# EAGLE schematic DAC STM32 Board v6.1 - AD5391 (EAGLE 9.6.1)

## Sheet 1 of 2
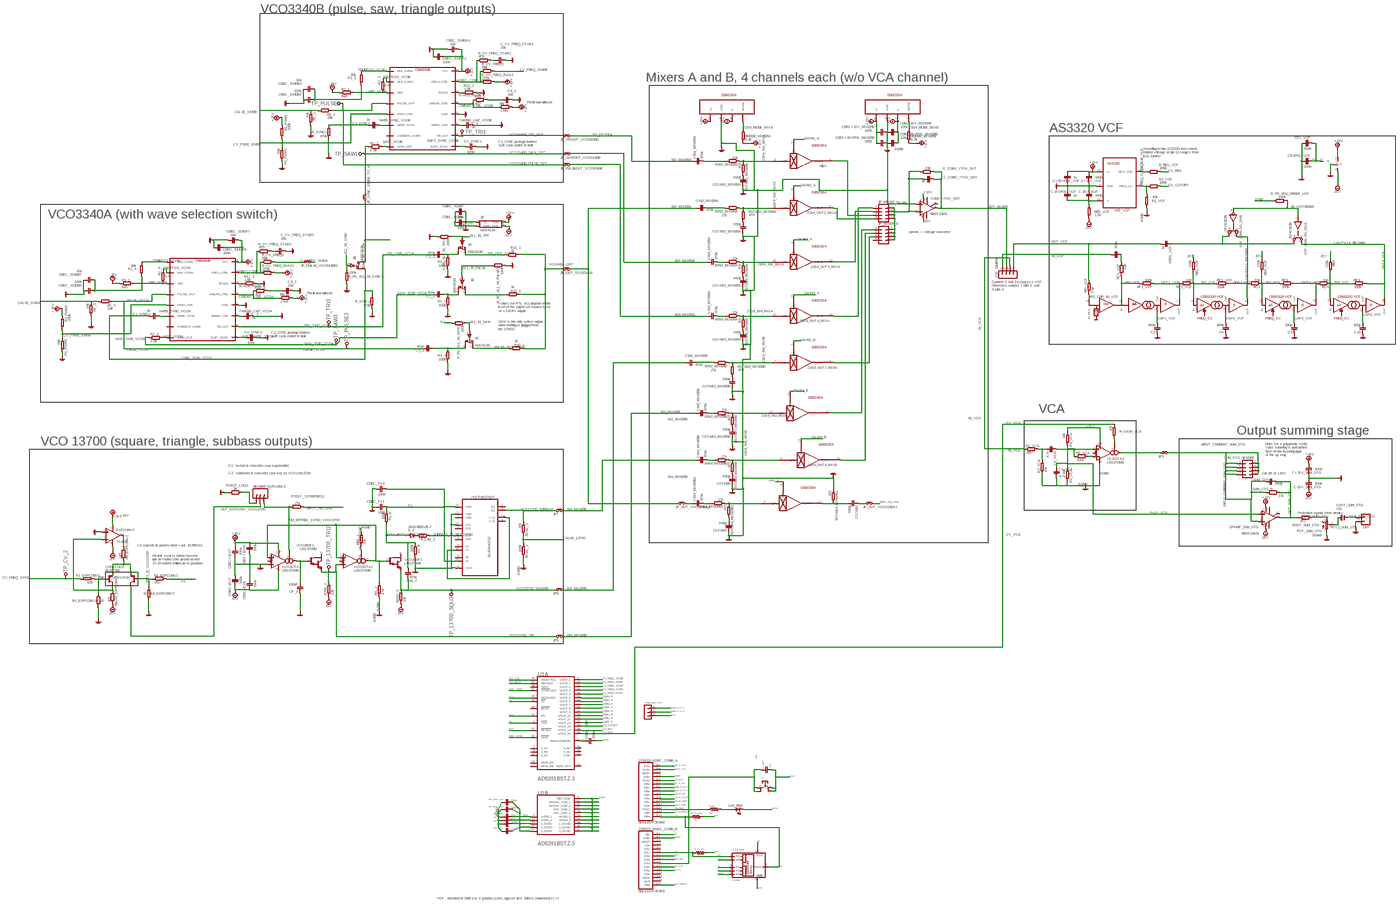
[diagram p0: schematic, sheet 1, overview]
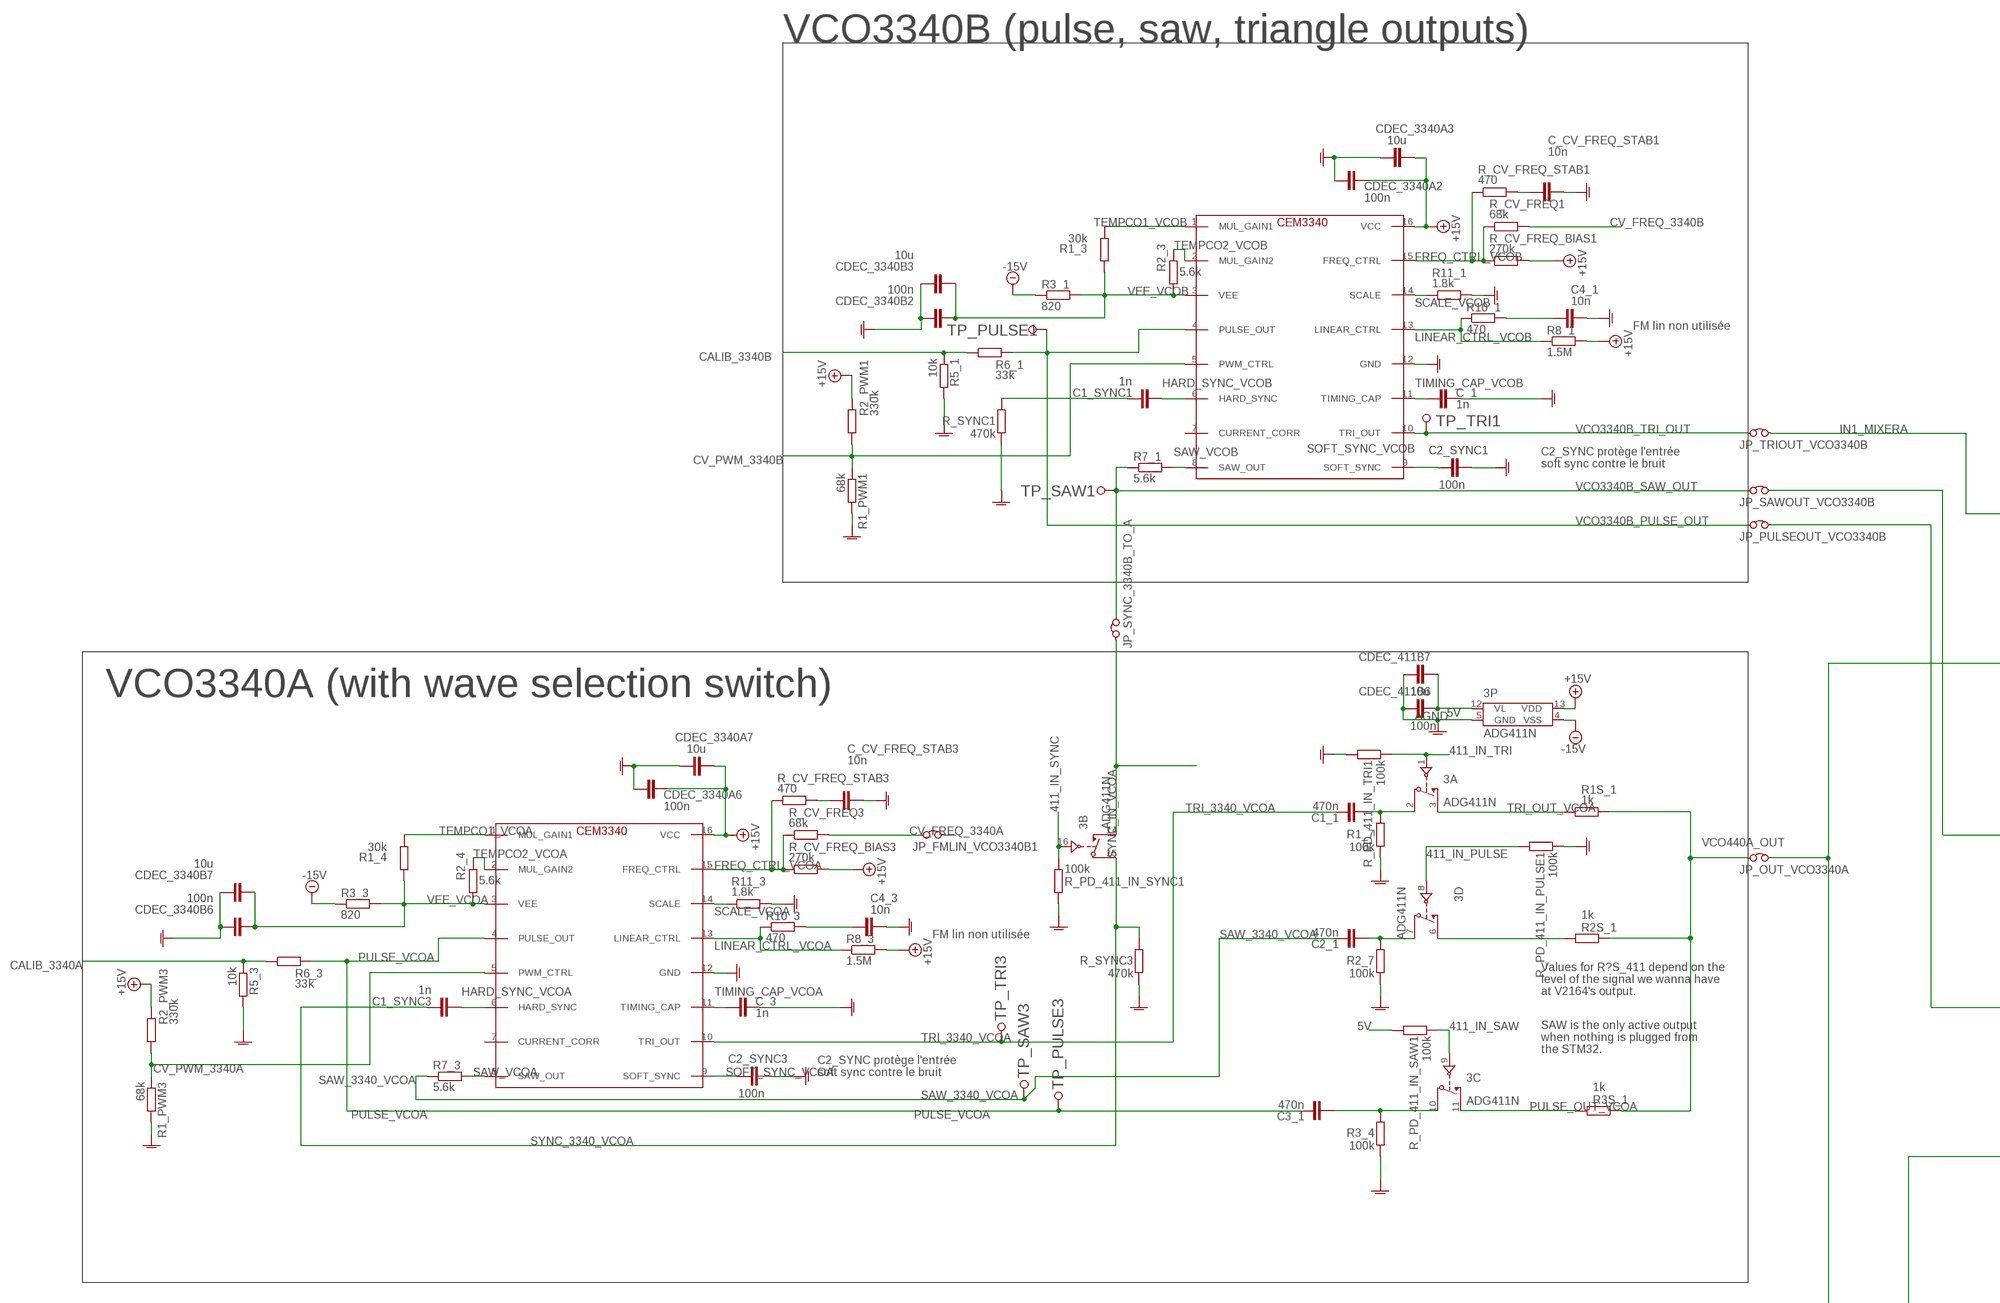
[diagram p1: schematic, sheet 1, part 1 of 4]
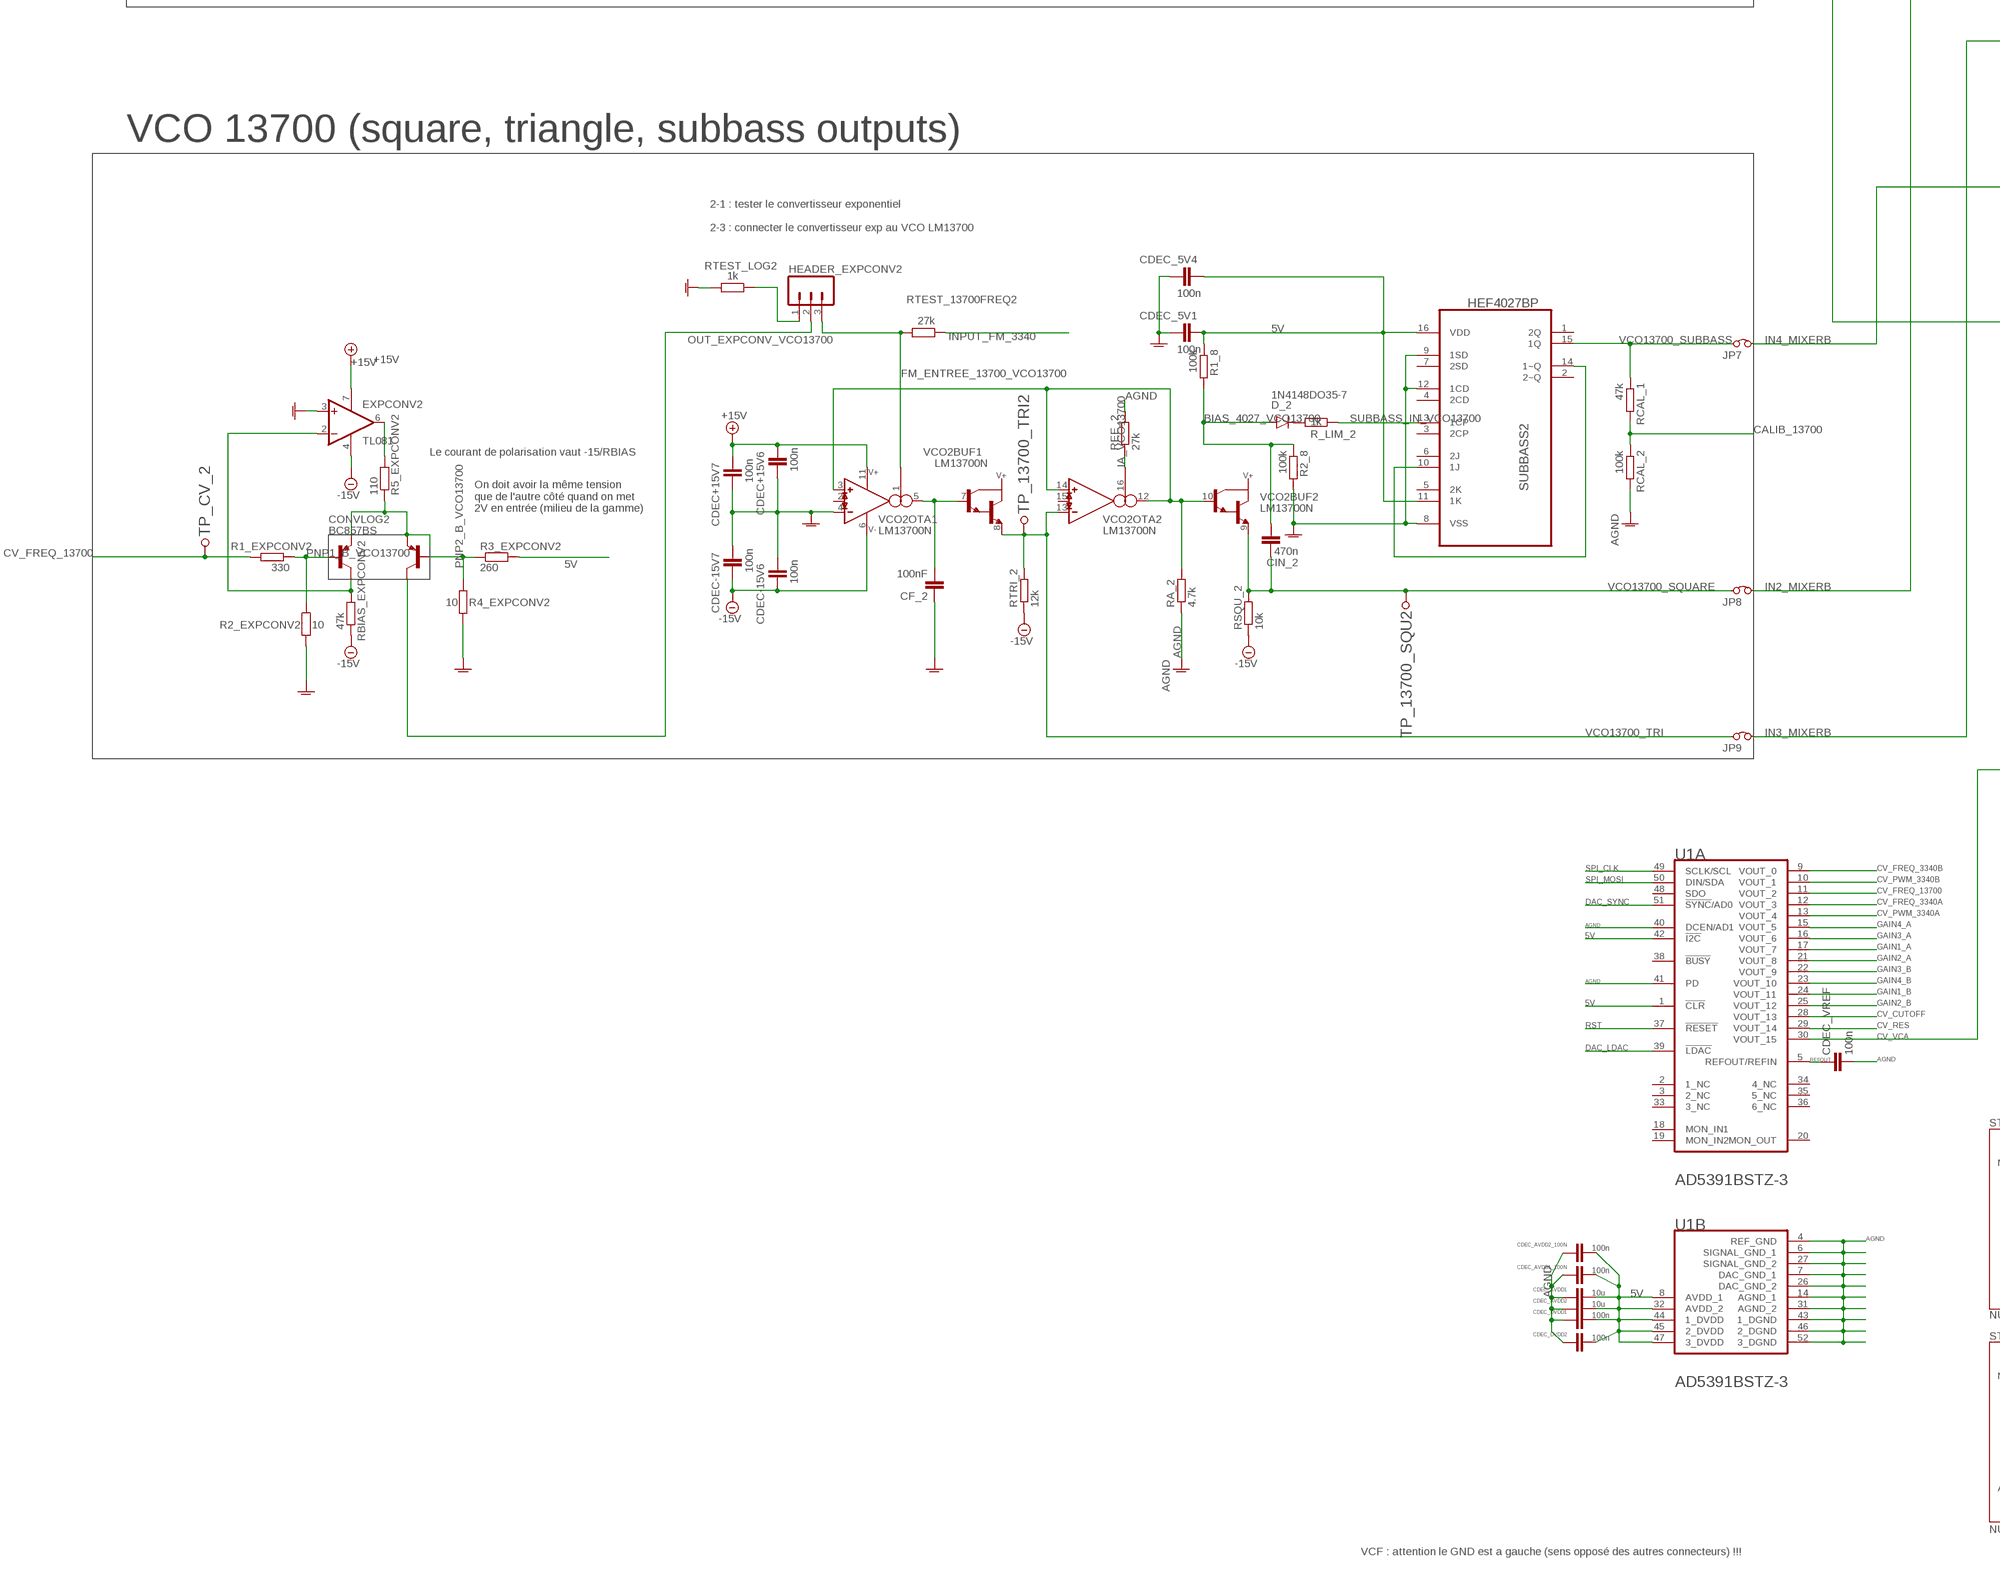
[diagram p2: schematic, sheet 1, part 2 of 4]
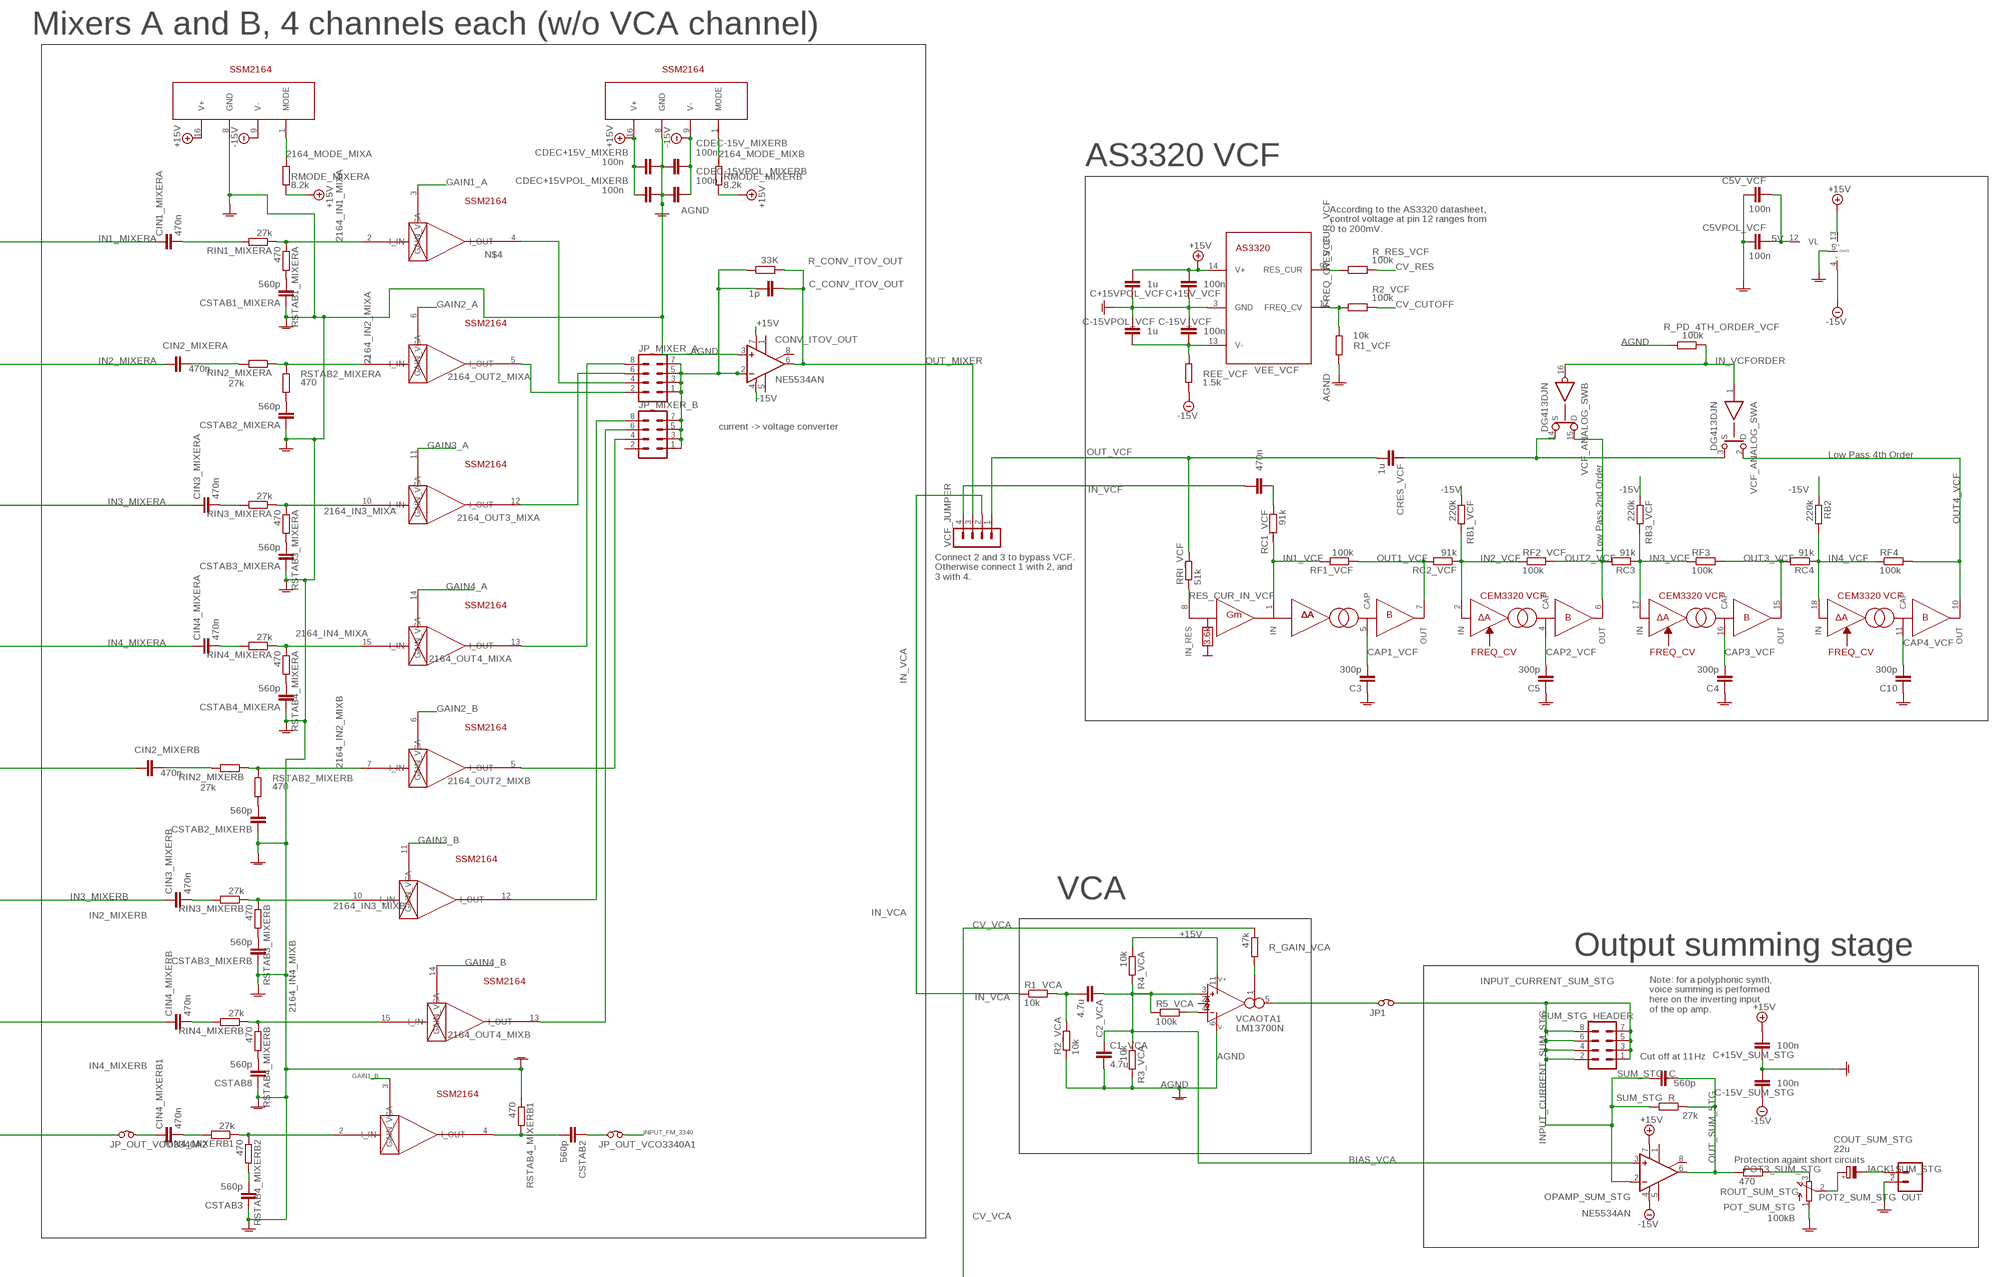
[diagram p3: schematic, sheet 1, part 3 of 4]
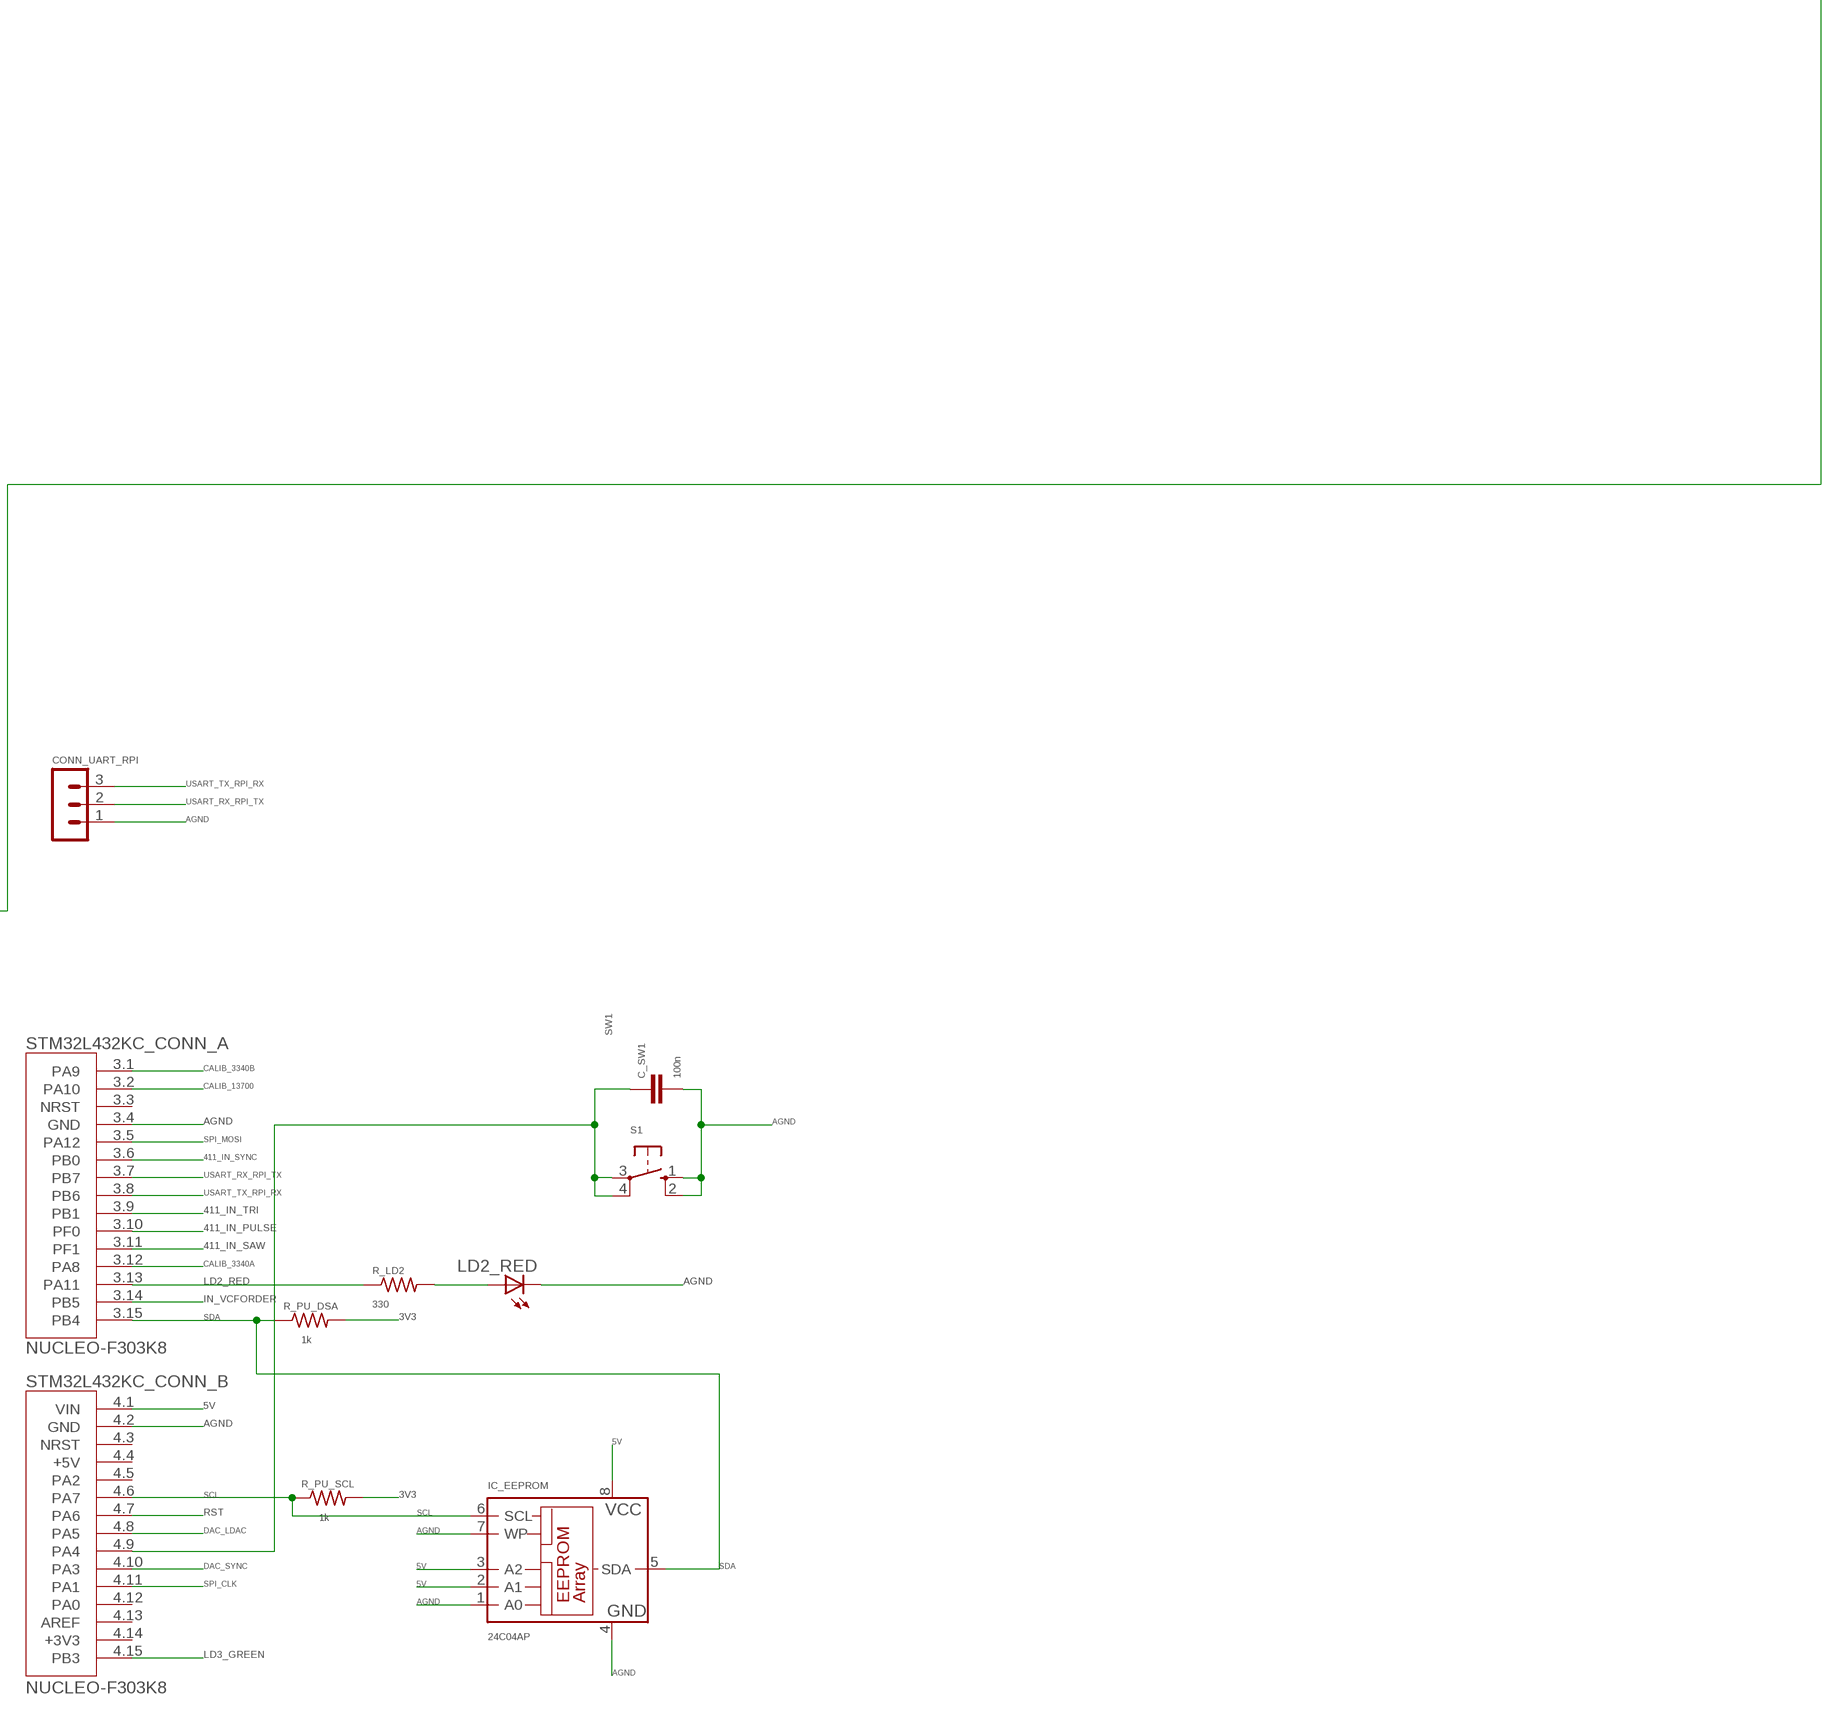
[diagram p4: schematic, sheet 1, part 4 of 4]

### Parts
3  ADG411N  [DIL16]
3340A  CEM3340  [DIL16]
3340B  CEM3340  [DIL16]
C1_1  470n  C-EU075-032X103  [C075-032X103]
C1_SYNC1  1n  C-EU075-032X103  [C075-032X103]
C1_SYNC3  1n  C-EU075-032X103  [C075-032X103]
C1_VCA  4.7u  C-EU050-030X075  [C050-030X075]
C2_1  470n  C-EU075-032X103  [C075-032X103]
C2_SYNC1  100n  C-EU075-032X103  [C075-032X103]
C2_SYNC3  100n  C-EU050-025X075  [C050-025X075]
C2_VCA  4.7u  C-EU050-030X075  [C050-030X075]
C3  300p  C-EU075-032X103  [C075-032X103]
C3_1  470n  C-EU102-043X133  [C102-043X133]
C4  300p  C-EU075-032X103  [C075-032X103]
C4_1  10n  C-EU050-025X075  [C050-025X075]
C4_3  10n  C-EU050-025X075  [C050-025X075]
C5  300p  C-EU075-032X103  [C075-032X103]
C5V_VCF  100n  C-EU075-032X103  [C075-032X103]
C5VPOL_VCF  100n  C-EU075-032X103  [C075-032X103]
C10  300p  C-EU075-032X103  [C075-032X103]
C+15V_SUM_STG  100n  C-EU075-032X103  [C075-032X103]
C+15V_VCF  100n  C-EU075-032X103  [C075-032X103]
C+15VPOL_VCF  1u  C-EU075-032X103  [C075-032X103]
C-15V_SUM_STG  100n  C-EU075-032X103  [C075-032X103]
C-15V_VCF  100n  C-EU075-032X103  [C075-032X103]
C-15VPOL_VCF  1u  C-EU075-032X103  [C075-032X103]
C_1  1n  C-EU050-025X075  [C050-025X075]
C_3  1n  C-EU050-025X075  [C050-025X075]
C_CONV_ITOV_OUT  1p  C-EU050-030X075  [C050-030X075]
C_CV_FREQ_STAB1  10n  C-EU075-032X103  [C075-032X103]
C_CV_FREQ_STAB3  10n  C-EU075-032X103  [C075-032X103]
C_IN2  470n  C-EU050-025X075  [C050-025X075]
C_SW1  100n  C-EU050-030X075  [C050-030X075]
CDEC+15V6  100n  C-EU075-032X103  [C075-032X103]
CDEC+15V7  100n  C-EU050-025X075  [C050-025X075]
CDEC+15V_MIXERB  100n  C-EU050-030X075  [C050-030X075]
CDEC+15VPOL_MIXERB  100n  C-EU075-032X103  [C075-032X103]
CDEC-15V6  100n  C-EU050-025X075  [C050-025X075]
CDEC-15V7  100n  C-EU075-032X103  [C075-032X103]
CDEC-15V_MIXERB  100n  C-EU050-030X075  [C050-030X075]
CDEC-15VPOL_MIXERB  100n  C-EU050-030X075  [C050-030X075]
CDEC_5V1  100n  C-EU050-025X075  [C050-025X075]
CDEC_5V4  100n  C-EU050-025X075  [C050-025X075]
CDEC_411B6  100n  C-EU050-025X075  [C050-025X075]
CDEC_411B7  10u  C-EU050-025X075  [C050-025X075]
CDEC_3340A2  100n  C-EU050-025X075  [C050-025X075]
CDEC_3340A3  10u  C-EU075-032X103  [C075-032X103]
CDEC_3340A6  100n  C-EU050-025X075  [C050-025X075]
CDEC_3340A7  10u  C-EU050-025X075  [C050-025X075]
CDEC_3340B2  100n  C-EU050-025X075  [C050-025X075]
CDEC_3340B3  10u  C-EU050-025X075  [C050-025X075]
CDEC_3340B6  100n  C-EU050-025X075  [C050-025X075]
CDEC_3340B7  10u  C-EU050-025X075  [C050-025X075]
CDEC_AVDD1  10u  C-EU050-030X075  [C050-030X075]
CDEC_AVDD1_100N  100n  C-EU050-030X075  [C050-030X075]
CDEC_AVDD2  10u  C-EU050-030X075  [C050-030X075]
CDEC_AVDD2_100N  100n  C-EU050-030X075  [C050-030X075]
CDEC_DVDD1  100n  C-EU075-032X103  [C075-032X103]
CDEC_DVDD2  100n  C-EU050-030X075  [C050-030X075]
CDEC_VREF  100n  C-EU050-030X075  [C050-030X075]
CF_2  100nF  C-EU050-025X075  [C050-025X075]
CIN1_MIXERA  470n  C-EU050-030X075  [C050-030X075]
CIN2_MIXERA  470n  C-EU050-030X075  [C050-030X075]
CIN2_MIXERB  470n  C-EU050-030X075  [C050-030X075]
CIN3_MIXERA  470n  C-EU050-030X075  [C050-030X075]
CIN3_MIXERB  470n  C-EU050-030X075  [C050-030X075]
CIN4_MIXERA  470n  C-EU050-030X075  [C050-030X075]
CIN4_MIXERB  470n  C-EU050-030X075  [C050-030X075]
CIN4_MIXERB1  470n  C-EU050-030X075  [C050-030X075]
CIN_2  470n  C-EU050-025X075  [C050-025X075]
CONN_UART_RPI  MA03-1  [MA03-1]
CONV_ITOV_OUT  NE5534AN  [DIL08]
CONVLOG2  BC857BS  [DIL06]
COUT_SUM_STG  22u  CPOL-EUB45181A  [B45181A]
CRES_VCF  1u  C-EU075-032X103  [C075-032X103]
CSTAB1_MIXERA  560p  C-EU050-030X075  [C050-030X075]
CSTAB2  560p  C-EU050-030X075  [C050-030X075]
CSTAB2_MIXERA  560p  C-EU050-030X075  [C050-030X075]
CSTAB2_MIXERB  560p  C-EU050-030X075  [C050-030X075]
CSTAB3  560p  C-EU050-030X075  [C050-030X075]
CSTAB3_MIXERA  560p  C-EU050-030X075  [C050-030X075]
CSTAB3_MIXERB  560p  C-EU050-030X075  [C050-030X075]
CSTAB4_MIXERA  560p  C-EU050-030X075  [C050-030X075]
CSTAB8  560p  C-EU050-030X075  [C050-030X075]
D_2  1N4148DO35-7  [DO35-7]
EXPCONV2  TL081  1AMP_P7+4N  [DIL08]
HEADER_EXPCONV2  M03  [03P]
IC_EEPROM  24C04AP  [DIL8]
JP1  JUMPER  [HDR2X1]
JP7  JUMPER  [HDR2X1]
JP8  JUMPER  [HDR2X1]
JP9  JUMPER  [HDR2X1]
JP_FMLIN_VCO3340B1  JUMPER  [HDR2X1]
JP_MIXER_A  MA04-2  [MA04-2]
JP_MIXER_B  MA04-2  [MA04-2]
JP_OUT_VCO3340A  JUMPER  [HDR2X1]
JP_OUT_VCO3340A1  JUMPER  [HDR2X1]
JP_OUT_VCO3340A2  JUMPER  [HDR2X1]
JP_PULSEOUT_VCO3340B  JUMPER  [HDR2X1]
JP_SAWOUT_VCO3340B  JUMPER  [HDR2X1]
JP_SYNC_3340B_TO_A  JUMPER  [HDR2X1]
JP_TRIOUT_VCO3340B  JUMPER  [HDR2X1]
LD2_RED  LED3MM  [LED3MM]
MIXER_A  SSM2164_MULTI  [DIL16]
MIXER_B  SSM2164_MULTI  [DIL16]
OPAMP_SUM_STG  NE5534AN  [DIL08]
OUT  MA02  [02PA]
POT_SUM_STG  100kB  3RP/1610N  [3RP/1610N]
R1_3  30k  R-EU_0204/7  [0204/7]
R1_4  30k  R-EU_0204/7  [0204/7]
R1_7  100k  R-EU_0204/7  [0204/7]
R1_8  100k  R-EU_0204/7  [0204/7]
R1_EXPCONV2  330  R-EU_0204/7  [0204/7]
R1_PWM1  68k  R-EU_0204/7  [0204/7]
R1_PWM3  68k  R-EU_0207/10  [0207/10]
R1_VCA  10k  R-EU_0204/7  [0204/7]
R1_VCF  10k  R-EU_0204/7  [0204/7]
R1S_1  1k  R-EU_0204/7  [0204/7]
R2_3  5.6k  R-EU_0204/7  [0204/7]
R2_4  5.6k  R-EU_0204/7  [0204/7]
R2_7  100k  R-EU_0207/10  [0207/10]
R2_8  100k  R-EU_0204/7  [0204/7]
R2_EXPCONV2  10  R-EU_0204/7  [0204/7]
R2_PWM1  330k  R-EU_0204/7  [0204/7]
R2_PWM3  330k  R-EU_0204/7  [0204/7]
R2_VCA  10k  R-EU_0204/7  [0204/7]
R2_VCF  100k  R-EU_0204/7  [0204/7]
R2S_1  1k  R-EU_0204/7  [0204/7]
R3_1  820  R-EU_0204/7  [0204/7]
R3_3  820  R-EU_0204/7  [0204/7]
R3_4  100k  R-EU_0207/10  [0207/10]
R3_EXPCONV2  260  R-EU_0204/7  [0204/7]
R3_VCA  10k  R-EU_0204/7  [0204/7]
R3S_1  1k  R-EU_0207/10  [0207/10]
R4_EXPCONV2  10  R-EU_0204/7  [0204/7]
R4_VCA  10k  R-EU_0204/7  [0204/7]
R5_1  10k  R-EU_0204/7  [0204/7]
R5_3  10k  R-EU_0204/7  [0204/7]
R5_EXPCONV2  110  R-EU_0204/7  [0204/7]
R5_VCA  100k  R-EU_0204/7  [0204/7]
R6_1  33k  R-EU_0204/7  [0204/7]
R6_3  33k  R-EU_0204/7  [0204/7]
R7_1  5.6k  R-EU_0207/10  [0207/10]
R7_3  5.6k  R-EU_0207/10  [0207/10]
R8_1  1.5M  R-EU_0204/7  [0204/7]
R8_3  1.5M  R-EU_0204/7  [0204/7]
R10_1  470  R-EU_0204/7  [0204/7]
R10_3  470  R-EU_0204/7  [0204/7]
R11_1  1.8k  R-EU_0204/7  [0204/7]
R11_3  1.8k  R-EU_0204/7  [0204/7]
R_CONV_ITOV_OUT  33K  R-EU_0204/7  [0204/7]
R_CV_FREQ1  68k  R-EU_0204/7  [0204/7]
R_CV_FREQ3  68k  R-EU_0204/7  [0204/7]
R_CV_FREQ_BIAS1  270k  R-EU_0204/7  [0204/7]
R_CV_FREQ_BIAS3  270k  R-EU_0204/7  [0204/7]
R_CV_FREQ_STAB1  470  R-EU_0204/7  [0204/7]
R_CV_FREQ_STAB3  470  R-EU_0204/7  [0204/7]
R_GAIN_VCA  47k  R-EU_0204/7  [0204/7]
R_LD2  330  R-US_0207/10  [0207/10]
R_LIM_2  1k  R-EU_0204/7  [0204/7]
R_PD_4TH_ORDER_VCF  100k  R-EU_0204/7  [0204/7]
R_PD_411_IN_PULSE1  100k  R-EU_0207/10  [0207/10]
R_PD_411_IN_SAW1  100k  R-EU_0204/7  [0204/7]
R_PD_411_IN_SYNC1  100k  R-EU_0204/7  [0204/7]
R_PD_411_IN_TRI1  100k  R-EU_0204/7  [0204/7]
R_PU_DSA  1k  R-US_0207/10  [0207/10]
R_PU_SCL  1k  R-US_0207/10  [0207/10]
R_RES_VCF  100k  R-EU_0204/7  [0204/7]
R_SYNC1  470k  R-EU_0204/7  [0204/7]
R_SYNC3  470k  R-EU_0204/7  [0204/7]
RA_2  4.7k  R-EU_0204/7  [0204/7]
RB1_VCF  220k  R-EU_0204/7  [0204/7]
RB2  220k  R-EU_0204/7  [0204/7]
RB3_VCF  220k  R-EU_0204/7  [0204/7]
RBIAS_EXPCONV2  47k  R-EU_0204/7  [0204/7]
RC1_VCF  91k  R-EU_0204/7  [0204/7]
RC2_VCF  91k  R-EU_0204/7  [0204/7]
RC3  91k  R-EU_0204/7  [0204/7]
RC4  91k  R-EU_0204/7  [0204/7]
RCAL_1  47k  R-EU_0204/7  [0204/7]
RCAL_2  100k  R-EU_0204/7  [0204/7]
REE_2  27k  R-EU_0204/7  [0204/7]
REE_VCF  1.5k  R-EU_0207/10  [0207/10]
RF1_VCF  100k  R-EU_0207/10  [0207/10]
RF2_VCF  100k  R-EU_0204/7  [0204/7]
RF3  100k  R-EU_0204/7  [0204/7]
RF4  100k  R-EU_0204/7  [0204/7]
RIN1_MIXERA  27k  R-EU_0204/7  [0204/7]
RIN2_MIXERA  27k  R-EU_0207/10  [0207/10]
RIN2_MIXERB  27k  R-EU_0204/7  [0204/7]
RIN3_MIXERA  27k  R-EU_0204/7  [0204/7]
RIN3_MIXERB  27k  R-EU_0204/7  [0204/7]
RIN4_MIXERA  27k  R-EU_0204/7  [0204/7]
RIN4_MIXERB  27k  R-EU_0204/7  [0204/7]
RIN4_MIXERB1  27k  R-EU_0204/7  [0204/7]
RMODE_MIXERA  8.2k  R-EU_0204/7  [0204/7]
RMODE_MIXERB  8.2k  R-EU_0204/7  [0204/7]
ROUT_SUM_STG  470  R-EU_0207/12  [0207/12]
RRI_VCF  51k  R-EU_0207/10  [0207/10]
RSQU_2  10k  R-EU_0204/7  [0204/7]
RSTAB1_MIXERA  470  R-EU_0204/7  [0204/7]
RSTAB2_MIXERA  470  R-EU_0207/10  [0207/10]
RSTAB2_MIXERB  470  R-EU_0207/10  [0207/10]
RSTAB3_MIXERA  470  R-EU_0204/7  [0204/7]
RSTAB3_MIXERB  470  R-EU_0204/7  [0204/7]
RSTAB4_MIXERA  470  R-EU_0204/7  [0204/7]
RSTAB4_MIXERB  470  R-EU_0204/7  [0204/7]
RSTAB4_MIXERB1  470  R-EU_0204/7  [0204/7]
RSTAB4_MIXERB2  470  R-EU_0204/7  [0204/7]
RTEST_13700FREQ2  27k  R-EU_0204/7  [0204/7]
RTEST_LOG2  1k  R-EU_0204/7  [0204/7]
RTRI_2  12k  R-EU_0204/7  [0204/7]
S1  10-XX  [B3F-10XX]
STM32L432KC_CONN_  NUCLEO-F303K8  [MODULE_NUCLEO-F303K8]
SUBBASS2  HEF4027BP  [DIP254P762X420-16]
SUM_STG_C  560p  C-EU075-032X103  [C075-032X103]
SUM_STG_HEADER  MA04-2  [MA04-2]
SUM_STG_R  27k  R-EU_0207/10  [0207/10]
TP_13700_SQU2  TESTPOINT  [TESTPOINT_63]
TP_13700_TRI2  TESTPOINT  [TESTPOINT_63]
TP_CV_2  TESTPOINT  [TESTPOINT_63]
TP_PULSE1  TESTPOINT  [TESTPOINT_63]
TP_PULSE3  TESTPOINT  [TESTPOINT_63]
TP_SAW1  TESTPOINT  [TESTPOINT_63]
TP_SAW3  TESTPOINT  [TESTPOINT_63]
TP_TRI1  TESTPOINT  [TESTPOINT_63]
TP_TRI3  TESTPOINT  [TESTPOINT_63]
U1  ANALOG_DEVICES_AD5391BSTZ-3ANALOG_DEVICES_AD5391BSTZ-3_0_0  [ANALOG_DEVICES_AD5391BSTZ-3_0]
VCA  LM13700N  [DIL16]
VCF  AS3320  [DIL18]
VCF_ANALOG_SW  DG413DJN  [DIL16]
VCF_JUMPER  MA04-1  [MA04-1]
VCO2  LM13700N  [DIL16]

### Nets
3V3: R_PU_DSA.2 R_PU_SCL.2
5V: 3.12(P:VL) C5V_VCF.1 C5VPOL_VCF.1 CDEC_5V1.1 CDEC_5V4.1 CDEC_411B6.1 CDEC_411B7.1 CDEC_AVDD1.2 CDEC_AVDD1_100N.2 CDEC_AVDD2.2 CDEC_AVDD2_100N.2 CDEC_DVDD1.2 CDEC_DVDD2.2 IC_EEPROM.2(A1) IC_EEPROM.3(A2) IC_EEPROM.8(VCC) R1_8.1 R3_EXPCONV2.2 R_PD_411_IN_SAW1.2 STM32L432KC_CONN_.4.1(B:VIN) SUBBASS2.11(1K) SUBBASS2.16(VDD) U1.1(A:!CLR!) U1.8(B:AVDD_1) U1.32(B:AVDD_2) U1.42(A:!I2C!) U1.44(B:1_DVDD) U1.45(B:2_DVDD) U1.47(B:3_DVDD) VCF_ANALOG_SW.12(VL:VL)
411_IN_PULSE: 3.8(D:IN) R_PD_411_IN_PULSE1.2 STM32L432KC_CONN_.3.10(A:PF0)
411_IN_SAW: 3.9(C:IN) R_PD_411_IN_SAW1.1 STM32L432KC_CONN_.3.11(A:PF1)
411_IN_SYNC: 3.16(B:IN) R_PD_411_IN_SYNC1.1 STM32L432KC_CONN_.3.6(A:PB0)
411_IN_TRI: 3.1(A:IN) R_PD_411_IN_TRI1.1 STM32L432KC_CONN_.3.9(A:PB1)
2164_IN1_MIXA: MIXER_A.2(I_IN) RIN1_MIXERA.1 RSTAB1_MIXERA.1
2164_IN2_MIXA: MIXER_A.7(I_IN) RIN2_MIXERA.1 RSTAB2_MIXERA.1
2164_IN2_MIXB: MIXER_B.7(I_IN) RIN2_MIXERB.1 RSTAB2_MIXERB.1
2164_IN3_MIXA: MIXER_A.10(I_IN) RIN3_MIXERA.1 RSTAB3_MIXERA.1
2164_IN3_MIXB: MIXER_B.10(I_IN) RIN3_MIXERB.1 RSTAB3_MIXERB.1
2164_IN4_MIXA: MIXER_A.15(I_IN) RIN4_MIXERA.1 RSTAB4_MIXERA.1
2164_IN4_MIXB: MIXER_B.15(I_IN) RIN4_MIXERB.1 RSTAB4_MIXERB.1
2164_IN4_MIXB1: MIXER_B.2(I_IN) RIN4_MIXERB1.1 RSTAB4_MIXERB2.1
2164_MODE_MIXA: MIXER_A.1(MODE) RMODE_MIXERA.2
2164_MODE_MIXB: MIXER_B.1(MODE) RMODE_MIXERB.2
2164_OUT2_MIXA: JP_MIXER_A.2 MIXER_A.5(I_OUT)
2164_OUT2_MIXB: JP_MIXER_B.4 MIXER_B.5(I_OUT)
2164_OUT3_MIXA: JP_MIXER_A.6 MIXER_A.12(I_OUT)
2164_OUT3_MIXB: JP_MIXER_B.8 MIXER_B.12(I_OUT)
2164_OUT4_MIXA: JP_MIXER_A.8 MIXER_A.13(I_OUT)
2164_OUT4_MIXB: JP_MIXER_B.6 MIXER_B.13(I_OUT)
+15V: 3.13(P:VDD) 3340A.16(VCC) 3340B.16(VCC) C+15V_SUM_STG.2 C+15V_VCF.2 C+15VPOL_VCF.2 CDEC+15V6.1 CDEC+15V7.1 CDEC+15V_MIXERB.2 CDEC+15VPOL_MIXERB.2 CDEC_3340A2.2 CDEC_3340A3.2 CDEC_3340A6.2 CDEC_3340A7.2 CONV_ITOV_OUT.7(V+) EXPCONV2.7(V+) MIXER_A.16(V+) MIXER_B.16(V+) OPAMP_SUM_STG.7(V+) R2_PWM1.2 R2_PWM3.2 R4_VCA.1 R8_1.2 R8_3.2 R_CV_FREQ_BIAS1.2 R_CV_FREQ_BIAS3.2 RMODE_MIXERA.1 RMODE_MIXERB.1 VCA.11(SUPPLY:V+) VCF.14(POW$1:V+) VCF_ANALOG_SW.13(P:V+) VCO2.11(SUPPLY:V+)
-15V: 3.4(P:VSS) C-15V_SUM_STG.1 CDEC-15V6.2 CDEC-15V7.2 CDEC-15V_MIXERB.1 CDEC-15VPOL_MIXERB.1 CONV_ITOV_OUT.4(V-) EXPCONV2.4(V-) MIXER_A.9(V-) MIXER_B.9(V-) OPAMP_SUM_STG.4(V-) R3_1.1 R3_3.1 RB1_VCF.1 RB2.1 RB3_VCF.1 RBIAS_EXPCONV2.1 REE_VCF.1 RSQU_2.1 RTRI_2.1 VCF_ANALOG_SW.4(P:V-) VCO2.6(SUPPLY:V-)
AGND: 3.5(P:GND) 3340A.12(GND) 3340B.12(GND) C1_VCA.2 C2_SYNC1.1 C2_SYNC3.1 C3.1 C4.1 C4_1.2 C4_3.2 C5.1 C5V_VCF.2 C5VPOL_VCF.2 C10.1 C+15V_SUM_STG.1 C+15V_VCF.1 C+15VPOL_VCF.1 C-15V_SUM_STG.2 C-15V_VCF.2 C-15VPOL_VCF.2 C_1.1 C_3.1 C_CV_FREQ_STAB1.1 C_CV_FREQ_STAB3.1 C_SW1.2 CDEC+15V6.2 CDEC+15V7.2 CDEC+15V_MIXERB.1 CDEC+15VPOL_MIXERB.1 CDEC-15V6.1 CDEC-15V7.1 CDEC-15V_MIXERB.2 CDEC-15VPOL_MIXERB.2 CDEC_5V1.2 CDEC_5V4.2 CDEC_411B6.2 CDEC_411B7.2 CDEC_3340A2.1 CDEC_3340A3.1 CDEC_3340A6.1 CDEC_3340A7.1 CDEC_3340B2.1 CDEC_3340B3.1 CDEC_3340B6.1 CDEC_3340B7.1 CDEC_AVDD1.1 CDEC_AVDD1_100N.1 CDEC_AVDD2.1 CDEC_AVDD2_100N.1 CDEC_DVDD1.1 CDEC_DVDD2.1 CDEC_VREF.2 CF_2.1 CONN_UART_RPI.1 CONV_ITOV_OUT.3(+IN) CSTAB1_MIXERA.1 CSTAB2_MIXERA.1 CSTAB2_MIXERB.1 CSTAB3.1 CSTAB3_MIXERA.1 CSTAB3_MIXERB.1 CSTAB4_MIXERA.1 CSTAB8.1 EXPCONV2.3(+IN) IC_EEPROM.1(A0) IC_EEPROM.4(GND) IC_EEPROM.7(WP) LD2_RED.K(C) MIXER_A.8(GND) MIXER_B.8(GND) OUT.2 POT_SUM_STG.1(A) R1_7.1 R1_PWM1.2 R1_PWM3.2 R1_VCF.2 R2_7.1 R2_8.2 R2_EXPCONV2.2 R2_VCA.1 R3_4.1 R3_VCA.2 R4_EXPCONV2.2 R5_1.2 R5_3.2 R11_1.2 R11_3.2 R_PD_4TH_ORDER_VCF.1 R_PD_411_IN_PULSE1.1 R_PD_411_IN_SYNC1.2 R_PD_411_IN_TRI1.2 R_SYNC1.1 R_SYNC3.1 RA_2.1 RCAL_2.2 REE_2.2 RSTAB4_MIXERB1.1 RTEST_LOG2.2 S1.1(S) S1.2(S1) STM32L432KC_CONN_.3.4(A:GND) STM32L432KC_CONN_.4.2(B:GND) SUBBASS2.8(VSS) SUBBASS2.9(1SD) SUBBASS2.12(1CD) U1.4(B:REF_GND) U1.6(B:SIGNAL_GND_1) U1.7(B:DAC_GND_1) U1.14(B:AGND_1) U1.26(B:DAC_GND_2) U1.27(B:SIGNAL_GND_2) U1.31(B:AGND_2) U1.40(A:DCEN/AD1) U1.41(A:PD) U1.43(B:1_DGND) U1.46(B:2_DGND) U1.52(B:3_DGND) VCA.6(SUPPLY:V-) VCF.3(POW$1:GND) VCF_ANALOG_SW.5(P:GND) VCO2.4(OTA1:IN_N)
BIAS_4027_VCO13700: CIN_2.1 D_2.A R1_8.2 R2_8.1
BIAS_VCA: C1_VCA.1 C2_VCA.1 OPAMP_SUM_STG.3(+IN) R3_VCA.1 R4_VCA.2 R5_VCA.1 VCA.3(OTA1:IN_P)
CALIB_3340A: R5_3.1 R6_3.1 STM32L432KC_CONN_.3.12(A:PA8)
CALIB_3340B: R5_1.1 R6_1.1 STM32L432KC_CONN_.3.1(A:PA9)
CALIB_13700: RCAL_1.2 RCAL_2.1 STM32L432KC_CONN_.3.2(A:PA10)
CAP1_VCF: C3.2 VCF.5(OTA$1:CAP)
CAP2_VCF: C5.2 VCF.4(OTA$2:CAP)
CAP3_VCF: C4.2 VCF.16(OTA$4:CAP)
CAP4_VCF: C10.2 VCF.11(OTA$3:CAP)
CV_CUTOFF: R2_VCF.2 U1.28(A:VOUT_13)
CV_FREQ_3340A: JP_FMLIN_VCO3340B1.1 R_CV_FREQ3.2 U1.12(A:VOUT_3)
CV_FREQ_3340B: R_CV_FREQ1.2 U1.9(A:VOUT_0)
CV_FREQ_13700: R1_EXPCONV2.2 TP_CV_2.P$1 U1.11(A:VOUT_2)
CV_PWM_3340A: 3340A.5(PWM_CTRL) R1_PWM3.1 R2_PWM3.1 U1.13(A:VOUT_4)
CV_PWM_3340B: 3340B.5(PWM_CTRL) R1_PWM1.1 R2_PWM1.1 U1.10(A:VOUT_1)
CV_RES: R_RES_VCF.2 U1.29(A:VOUT_14)
CV_VCA: R_GAIN_VCA.1 U1.30(A:VOUT_15)
DAC_LDAC: STM32L432KC_CONN_.4.8(B:PA5) U1.39(A:!LDAC!)
DAC_SYNC: STM32L432KC_CONN_.4.10(B:PA3) U1.51(A:!SYNC!/AD0)
FM_ENTREE_13700_VCO13700: HEADER_EXPCONV2.3 RTEST_13700FREQ2.2 VCO2.1(OTA1:I_BIAS)
FREQ_CTRL_VCOA: 3340A.15(FREQ_CTRL) R_CV_FREQ3.1 R_CV_FREQ_BIAS3.1 R_CV_FREQ_STAB3.1
FREQ_CTRL_VCOB: 3340B.15(FREQ_CTRL) R_CV_FREQ1.1 R_CV_FREQ_BIAS1.1 R_CV_FREQ_STAB1.1
FREQ_CV_VCF: R1_VCF.1 R2_VCF.1 VCF.12(POW$1:FREQ_CV)
GAIN1_A: MIXER_A.3(GAIN_VCA) U1.17(A:VOUT_7)
GAIN1_B: MIXER_B.3(GAIN_VCA) U1.24(A:VOUT_11)
GAIN2_A: MIXER_A.6(GAIN_VCA) U1.21(A:VOUT_8)
GAIN2_B: MIXER_B.6(GAIN_VCA) U1.25(A:VOUT_12)
GAIN3_A: MIXER_A.11(GAIN_VCA) U1.16(A:VOUT_6)
GAIN3_B: MIXER_B.11(GAIN_VCA) U1.22(A:VOUT_9)
GAIN4_A: MIXER_A.14(GAIN_VCA) U1.15(A:VOUT_5)
GAIN4_B: MIXER_B.14(GAIN_VCA) U1.23(A:VOUT_10)
HARD_SYNC_VCOA: 3340A.6(HARD_SYNC) C1_SYNC3.2
HARD_SYNC_VCOB: 3340B.6(HARD_SYNC) C1_SYNC1.2
IA_VCO13700: REE_2.1 VCO2.16(OTA2:I_BIAS)
IN1_MIXERA: CIN1_MIXERA.1 JP_TRIOUT_VCO3340B.2
IN1_VCF: RC1_VCF.2 RF1_VCF.2 VCF.1(OTA$1:IN)
IN2_MIXERA: CIN2_MIXERA.1 JP_OUT_VCO3340A2.1 JP_OUT_VCO3340A.2
IN2_MIXERB: CIN2_MIXERB.1 JP8.2
IN2_VCF: RB1_VCF.2 RC2_VCF.1 RF2_VCF.1 VCF.2(OTA$2:IN)
IN3_MIXERA: CIN3_MIXERA.1 JP_SAWOUT_VCO3340B.2
IN3_MIXERB: CIN3_MIXERB.1 JP9.2
IN3_VCF: RB3_VCF.2 RC3.1 RF3.1 VCF.17(OTA$4:IN)
IN4_MIXERA: CIN4_MIXERA.1 JP_PULSEOUT_VCO3340B.2
IN4_MIXERB: CIN4_MIXERB.1 JP7.2
IN4_MIXERB1: CIN4_MIXERB1.1 JP_OUT_VCO3340A2.2
IN4_VCF: RB2.2 RC4.1 RF4.1 VCF.18(OTA$3:IN)
IN_VCA: R1_VCA.1 VCF_JUMPER.2
IN_VCF: C_IN2.2 VCF_JUMPER.4
IN_VCFORDER: R_PD_4TH_ORDER_VCF.2 STM32L432KC_CONN_.3.14(A:PB5) VCF_ANALOG_SW.1(A:IN) VCF_ANALOG_SW.16(B:IN)
INPUT_CURRENT_SUM_STG: JP1.1 JP1.2 OPAMP_SUM_STG.2(-IN) SUM_STG_C.2 SUM_STG_HEADER.1 SUM_STG_HEADER.2 SUM_STG_HEADER.3 SUM_STG_HEADER.4 SUM_STG_HEADER.5 SUM_STG_HEADER.6 SUM_STG_HEADER.7 SUM_STG_HEADER.8 SUM_STG_R.2 VCA.5(OTA1:OUT)
INPUT_FM_3340: JP_OUT_VCO3340A1.2 RTEST_13700FREQ2.1
JACK_SUM_STG: COUT_SUM_STG.- OUT.1
LD2_RED: R_LD2.1 STM32L432KC_CONN_.3.13(A:PA11)
LD3_GREEN: STM32L432KC_CONN_.4.15(B:PB3)
LINEAR_CTRL_VCOA: 3340A.13(LINEAR_CTRL) R8_3.1 R10_3.1
LINEAR_CTRL_VCOB: 3340B.13(LINEAR_CTRL) R8_1.1 R10_1.1
MIXER_OUT1: C_CONV_ITOV_OUT.1 CONV_ITOV_OUT.2(-IN) JP_MIXER_A.1 JP_MIXER_A.3 JP_MIXER_A.5 JP_MIXER_A.7 JP_MIXER_B.1 JP_MIXER_B.3 JP_MIXER_B.5 JP_MIXER_B.7 R_CONV_ITOV_OUT.1
N$1: CSTAB2.1 JP_OUT_VCO3340A1.1
N$2: JP_FMLIN_VCO3340B1.2
N$4: JP_MIXER_A.4 MIXER_A.4(I_OUT)
N$7: LD2_RED.A R_LD2.2
N$8: CSTAB2.2 MIXER_B.4(I_OUT) RSTAB4_MIXERB1.2
N$10: CSTAB3.2 RSTAB4_MIXERB2.2
N$11: CIN4_MIXERB1.2 RIN4_MIXERB1.2
N$12: R5_VCA.2 VCA.4(OTA1:IN_N)
N$13: C2_VCA.2 R1_VCA.2 R2_VCA.2
N$17: R_GAIN_VCA.2 VCA.1(OTA1:I_BIAS)
N$20: CSTAB2_MIXERB.2 RSTAB2_MIXERB.2
N$22: CSTAB3_MIXERB.2 RSTAB3_MIXERB.2
N$24: CSTAB8.2 RSTAB4_MIXERB.2
N$65: CIN3_MIXERB.2 RIN3_MIXERB.2
N$69: CIN2_MIXERB.2 RIN2_MIXERB.2
N$70: CIN4_MIXERB.2 RIN4_MIXERB.2
N$74: CSTAB2_MIXERA.2 RSTAB2_MIXERA.2
N$75: CSTAB1_MIXERA.2 RSTAB1_MIXERA.2
N$76: CSTAB3_MIXERA.2 RSTAB3_MIXERA.2
N$77: CSTAB4_MIXERA.2 RSTAB4_MIXERA.2
N$78: CIN1_MIXERA.2 RIN1_MIXERA.2
N$79: CIN3_MIXERA.2 RIN3_MIXERA.2
N$80: CIN2_MIXERA.2 RIN2_MIXERA.2
N$81: CIN4_MIXERA.2 RIN4_MIXERA.2
N$82: C_CV_FREQ_STAB1.2 R_CV_FREQ_STAB1.2
N$83: C4_1.1 R10_1.2
N$86: C_CV_FREQ_STAB3.2 R_CV_FREQ_STAB3.2
N$87: C4_3.1 R10_3.2
N$88: 3.2(A:D) C1_1.2 R1_7.2
N$89: 3.7(D:D) C2_1.2 R2_7.2
N$90: 3.10(C:D) C3_1.2 R3_4.2
N$91: 3.6(D:S) R2S_1.2
N$94: EXPCONV2.6(OUT) R5_EXPCONV2.2
N$95: RA_2.2 VCO2.3(OTA1:IN_P) VCO2.10(BUF2:B) VCO2.12(OTA2:OUT) VCO2.14(OTA2:IN_P)
N$96: CF_2.2 VCO2.5(OTA1:OUT) VCO2.7(BUF1:B)
N$97: SUBBASS2.10(1J) SUBBASS2.14(1~Q)
N$98: D_2.C R_LIM_2.2
N$99: HEADER_EXPCONV2.1 RTEST_LOG2.1
N$113: CRES_VCF.1 VCF_ANALOG_SW.3(A:S) VCF_ANALOG_SW.14(B:S)
N$116: C_IN2.1 RC1_VCF.1
OUT1_VCF: RC2_VCF.2 RF1_VCF.1 VCF.7(OTA$1:OUT)
OUT2_VCF: RC3.2 RF2_VCF.2 VCF.6(OTA$2:OUT) VCF_ANALOG_SW.15(B:D)
OUT3_VCF: RC4.2 RF3.2 VCF.15(OTA$4:OUT)
OUT4_VCF: RF4.2 VCF.10(OTA$3:OUT) VCF_ANALOG_SW.2(A:D)
OUT_EXPCONV_VCO13700: CONVLOG2.3(C2) HEADER_EXPCONV2.2
OUT_MIXER: C_CONV_ITOV_OUT.2 CONV_ITOV_OUT.6(OUT) R_CONV_ITOV_OUT.2 VCF_JUMPER.3
OUT_SUM_STG: OPAMP_SUM_STG.6(OUT) ROUT_SUM_STG.2 SUM_STG_C.1 SUM_STG_R.1
OUT_VCF: CRES_VCF.2 RRI_VCF.2 VCF_JUMPER.1
PNP1_B_VCO13700: CONVLOG2.2(B1) R1_EXPCONV2.1 R2_EXPCONV2.1
PNP1_C1_VCO1: CONVLOG2.6(C1) EXPCONV2.2(-IN) RBIAS_EXPCONV2.2
PNP2_B_VCO13700: CONVLOG2.5(B2) R3_EXPCONV2.1 R4_EXPCONV2.1
PNP_E1-VCO1_MIXB: CONVLOG2.1(E1) CONVLOG2.4(E2) R5_EXPCONV2.1
POT2_SUM_STG: COUT_SUM_STG.+ POT_SUM_STG.2(S)
POT3_SUM_STG: POT_SUM_STG.3(E) ROUT_SUM_STG.1
PULSE_OUT_VCOA: 3.11(C:S) R3S_1.2
PULSE_VCOA: 3340A.4(PULSE_OUT) C3_1.1 R6_3.2 TP_PULSE3.P$1
REFOUT: CDEC_VREF.1 U1.5(A:REFOUT/REFIN)
RES_CUR_IN_VCF: RRI_VCF.1 VCF.8(OTA$1:IN_RES)
RES_CUR_VCF: R_RES_VCF.1 VCF.9(POW$1:RES_CUR)
RST: STM32L432KC_CONN_.4.7(B:PA6) U1.37(A:!RESET!)
SAW_3340_VCOA: C2_1.1 R7_3.1 TP_SAW3.P$1
SAW_VCOA: 3340A.8(SAW_OUT) R7_3.2
SAW_VCOB: 3340B.8(SAW_OUT) R7_1.2
SCALE_VCOA: 3340A.14(SCALE) R11_3.1
SCALE_VCOB: 3340B.14(SCALE) R11_1.1
SCL: IC_EEPROM.6(SCL) R_PU_SCL.1 STM32L432KC_CONN_.4.6(B:PA7)
SDA: IC_EEPROM.5(SDA) R_PU_DSA.1 STM32L432KC_CONN_.3.15(A:PB4)
SOFT_SYNC_VCOA: 3340A.9(SOFT_SYNC) C2_SYNC3.2
SOFT_SYNC_VCOB: 3340B.9(SOFT_SYNC) C2_SYNC1.2
SPI_CLK: STM32L432KC_CONN_.4.11(B:PA1) U1.49(A:SCLK/SCL)
SPI_MOSI: STM32L432KC_CONN_.3.5(A:PA12) U1.50(A:DIN/SDA)
SUBBASS_IN_VCO13700: R_LIM_2.1 SUBBASS2.13(1CP)
SW1: C_SW1.1 S1.3(P) S1.4(P1) STM32L432KC_CONN_.4.9(B:PA4)
SYNC_3340_VCOA: 3.15(B:D) C1_SYNC3.1 R_SYNC3.2
SYNC_3340_VCOB: C1_SYNC1.1 R_SYNC1.2
SYNC_IN_VCOA: 3.14(B:S) JP_SYNC_3340B_TO_A.1
TEMPCO1_VCOA: 3340A.1(MUL_GAIN1) R1_4.1
TEMPCO1_VCOB: 3340B.1(MUL_GAIN1) R1_3.1
TEMPCO2_VCOA: 3340A.2(MUL_GAIN2) R2_4.1
TEMPCO2_VCOB: 3340B.2(MUL_GAIN2) R2_3.1
TIMING_CAP_VCOA: 3340A.11(TIMING_CAP) C_3.2
TIMING_CAP_VCOB: 3340B.11(TIMING_CAP) C_1.2
TRI_3340_VCOA: 3340A.10(TRI_OUT) C1_1.1 TP_TRI3.P$1
TRI_OUT_VCOA: 3.3(A:S) R1S_1.1
USART_RX_RPI_TX: CONN_UART_RPI.2 STM32L432KC_CONN_.3.7(A:PB7)
USART_TX_RPI_RX: CONN_UART_RPI.3 STM32L432KC_CONN_.3.8(A:PB6)
VCO440A_OUT: JP_OUT_VCO3340A.1 R1S_1.2 R2S_1.1 R3S_1.1
VCO3340B_PULSE_OUT: 3340B.4(PULSE_OUT) JP_PULSEOUT_VCO3340B.1 R6_1.2 TP_PULSE1.P$1
VCO3340B_SAW_OUT: JP_SAWOUT_VCO3340B.1 JP_SYNC_3340B_TO_A.2 R7_1.1 TP_SAW1.P$1
VCO3340B_TRI_OUT: 3340B.10(TRI_OUT) JP_TRIOUT_VCO3340B.1 TP_TRI1.P$1
VCO13700_SQUARE: CIN_2.2 JP8.1 RSQU_2.2 TP_13700_SQU2.P$1 VCO2.9(BUF2:E)
VCO13700_SUBBASS: JP7.1 RCAL_1.1 SUBBASS2.15(1Q)
VCO13700_TRI: JP9.1 RTRI_2.2 TP_13700_TRI2.P$1 VCO2.8(BUF1:E) VCO2.13(OTA2:IN_N)
VEE_VCF: C-15V_VCF.1 C-15VPOL_VCF.1 REE_VCF.2 VCF.13(POW$1:V-)
VEE_VCOA: 3340A.3(VEE) CDEC_3340B6.2 CDEC_3340B7.2 R1_4.2 R2_4.2 R3_3.2
VEE_VCOB: 3340B.3(VEE) CDEC_3340B2.2 CDEC_3340B3.2 R1_3.2 R2_3.2 R3_1.2
Unconnected: 3340A.7(CURRENT_CORR) 3340B.7(CURRENT_CORR) CONV_ITOV_OUT.1(ON) CONV_ITOV_OUT.5(CMP) CONV_ITOV_OUT.8(ON/CMP) JP_MIXER_B.2 OPAMP_SUM_STG.1(ON) OPAMP_SUM_STG.5(CMP) OPAMP_SUM_STG.8(ON/CMP) STM32L432KC_CONN_.3.3(A:NRST) STM32L432KC_CONN_.4.3(B:NRST) STM32L432KC_CONN_.4.4(B:+5V) STM32L432KC_CONN_.4.5(B:PA2) STM32L432KC_CONN_.4.12(B:PA0) STM32L432KC_CONN_.4.13(B:AREF) STM32L432KC_CONN_.4.14(B:+3V3) SUBBASS2.1(2Q) SUBBASS2.2(2~Q) SUBBASS2.3(2CP) SUBBASS2.4(2CD) SUBBASS2.5(2K) SUBBASS2.6(2J) SUBBASS2.7(2SD) U1.2(A:1_NC) U1.3(A:2_NC) U1.18(A:MON_IN1) U1.19(A:MON_IN2) U1.20(A:MON_OUT) U1.33(A:3_NC) U1.34(A:4_NC) U1.35(A:5_NC) U1.36(A:6_NC) U1.38(A:!BUSY!) U1.48(A:SDO) VCA.2(OTA1:I_DIODE) VCA.7(BUF1:B) VCA.8(BUF1:E) VCA.9(BUF2:E) VCA.10(BUF2:B) VCA.12(OTA2:OUT) VCA.13(OTA2:IN_N) VCA.14(OTA2:IN_P) VCA.15(OTA2:I_DIODE) VCA.16(OTA2:I_BIAS) VCF_ANALOG_SW.6(D:S) VCF_ANALOG_SW.7(D:D) VCF_ANALOG_SW.8(D:IN) VCF_ANALOG_SW.9(C:IN) VCF_ANALOG_SW.10(C:D) VCF_ANALOG_SW.11(C:S) VCO2.2(OTA1:I_DIODE) VCO2.15(OTA2:I_DIODE)

### Notes on the sheet
- VCO3340B (pulse, saw, triangle outputs)
- Mixers A and B, 4 channels each (w/o VCA channel)
- FM lin non utilisée
- AS3320 VCF
- C2_SYNC protège l'entrée 
  soft sync contre le bruit
- According to the AS3320 datasheet, 
  control voltage at pin 12 ranges from
  0 to 200mV.
- VCO3340A (with wave selection switch)
- current -> voltage converter
- Low Pass 4th Order
- Low Pass 2nd Order
- Connect 2 and 3 to bypass VCF.
  Otherwise connect 1 with 2, and
  3 with 4.
- FM lin non utilisée
- Values for R?S_411 depend on the 
  level of the signal we wanna have
  at V2164's output.
- SAW is the only active output 
  when nothing is plugged from 
  the STM32.
- C2_SYNC protège l'entrée 
  soft sync contre le bruit
- VCA
- Output summing stage
- VCO 13700 (square, triangle, subbass outputs)
- Note: for a polyphonic synth, 
  voice summing is performed 
  here on the inverting input 
  of the op amp.
- 2-1 : tester le convertisseur exponentiel
  
  2-3 : connecter le convertisseur exp au VCO LM13700
- Cut off at 11Hz
- Protection againt short circuits
- Le courant de polarisation vaut -15/RBIAS
- On doit avoir la même tension 
  que de l'autre côté quand on met
  2V en entrée (milieu de la gamme)
- VCF : attention le GND est a gauche (sens opposé des autres connecteurs) !!!

## Sheet 2 of 2

## Library data of the parts
3 = analog-devices:ADG411: LC2MOS Precision Quad SPST Switches Source: http://www.analog.com/static/imported-files/data_sheets/ADG411_412_413.pdf; MF: ALTERA CORPORATION; MPN: ADG411BN; OC_FARNELL: 1424317; OC_NEWARK: 05F6198
3340A 3340B = analog-audio-chips:CEM3340: Voltage Controlled Oscillator designed by Curtis.
C1_1 C1_SYNC1 C1_SYNC3 C1_VCA C2_1 C2_SYNC1 C2_SYNC3 C2_VCA C3 C3_1 C4 C4_1 C4_3 C5 C5V_VCF C5VPOL_VCF C10 C+15V_SUM_STG C+15V_VCF C+15VPOL_VCF C-15V_SUM_STG C-15V_VCF C-15VPOL_VCF C_1 C_3 C_CV_FREQ_STAB1 C_CV_FREQ_STAB3 C_IN2 CDEC+15V6 CDEC+15V7 CDEC+15V_MIXERB CDEC+15VPOL_MIXERB CDEC-15V6 CDEC-15V7 CDEC-15V_MIXERB CDEC-15VPOL_MIXERB CDEC_5V1 CDEC_5V4 CDEC_411B6 CDEC_411B7 CDEC_3340A2 CDEC_3340A3 CDEC_3340A6 CDEC_3340A7 CDEC_3340B2 CDEC_3340B3 CDEC_3340B6 CDEC_3340B7 CF_2 CIN_2 CRES_VCF CSTAB1_MIXERA CSTAB2 CSTAB2_MIXERA CSTAB2_MIXERB CSTAB3 CSTAB3_MIXERA CSTAB3_MIXERB CSTAB4_MIXERA CSTAB8 SUM_STG_C = rcl:C-EU: CAPACITOR, European symbol; SPICEPREFIX: C
C_CONV_ITOV_OUT CIN1_MIXERA CIN2_MIXERA CIN2_MIXERB CIN3_MIXERA CIN3_MIXERB CIN4_MIXERA CIN4_MIXERB CIN4_MIXERB1 = rcl:C-EU: CAPACITOR, European symbol; C3: 0.47 micro; SPICEPREFIX: C
C_SW1 CDEC_AVDD1 CDEC_AVDD1_100N CDEC_AVDD2 CDEC_AVDD2_100N CDEC_DVDD1 CDEC_DVDD2 CDEC_VREF = 6P1_EVB:C-EU: CAPACITOR, European symbol
CONN_UART_RPI = con-lstb:MA03-1: PIN HEADER; OC_FARNELL: unknown; OC_NEWARK: unknown
CONV_ITOV_OUT OPAMP_SUM_STG = linear:NE5534: LOW-NOISE OPERATIONAL AMPLIFIER Source: http://focus.ti.com/lit/ds/symlink/ne5534.pdf
CONVLOG2 = paires_diff:BC857BS
COUT_SUM_STG = resistor:CPOL-EU: POLARIZED CAPACITOR, European symbol
D_2 = diode:1N4148: DIODE high speed (Philips)
EXPCONV2 = linear:1AMP_P7+4: OP AMP
HEADER_EXPCONV2 = con-amp-quick:M03: AMP QUICK CONNECTOR; OC_FARNELL: unknown; OC_NEWARK: unknown
IC_EEPROM = microchip:24C*: Serial EEPROM 1 K/2 K/4 K; MPN: AT24C04B-PU; OC_FARNELL: 1362642; OC_NEWARK: 50M3315
JP1 JP7-JP9 JP_FMLIN_VCO3340B1 JP_OUT_VCO3340A JP_OUT_VCO3340A1 JP_OUT_VCO3340A2 JP_PULSEOUT_VCO3340B JP_SAWOUT_VCO3340B JP_SYNC_3340B_TO_A JP_TRIOUT_VCO3340B = 6P1_EVB:JUMPER: Wire jumper .1" C
JP_MIXER_A JP_MIXER_B SUM_STG_HEADER = con-lstb:MA04-2: PIN HEADER; OC_FARNELL: unknown; OC_NEWARK: unknown
LD2_RED = adafruit:LED: LED OSRAM: - CHIPLED LG R971, LG N971, LY N971, LG Q971, LY Q971, LO R971, LY R971 LH N974, LH R974 LS Q976, LO Q976, LY Q976 LO Q996 - Hyper CHIPLED LW Q18S LB Q993, LB Q99A, LB R99A - SideLED LS A670, LO A670, LY A670, LG A670, LP A670 LB A673, LV A673, LT A673, LW A673 LH A674 LY A675 LS A676, LA A676, LO A676, LY A676, LW A676 LS A679, LY A679, LG A679 - Hyper Micro SIDELED® LS Y876, LA Y876, LO Y876, LY Y876 LT Y87S - SmartLED LW L88C, LW L88S LB L89C, LB L89S, LG L890 LS L89K, LO L89K, LY L89K LS L896, LA L896, LO L896, LY L896 - TOPLED LS T670, LO T670, LY T670, LG T670, LP T670 LSG T670, LSP T670, LSY T670, LOP T670, LYG T670 LG T671, LOG T671, LSG T671 LB T673, LV T673, LT T673, LW T673 LH T674 LS T676, LA T676, LO T676, LY T676, LB T676, LH T676, LSB T676, LW T676 LB T67C, LV T67C, LT T67C, LS T67K, LO T67K, LY T67K, LW E67C LS E67B, LA E67B, LO E67B, LY E67B, LB E67C, LV E67C, LT E67C LW T67C LS T679, LY T679, LG T679 LS T770, LO T770, LY T770, LG T770, LP T770 LB T773, LV T773, LT T773, LW T773 LH T774 LS E675, LA E675, LY E675, LS T675 LS T776, LA T776, LO T776, LY T776, LB T776 LHGB T686 LT T68C, LB T68C - Hyper Mini TOPLED® LB M676 - Mini TOPLED Santana® LG M470 LS M47K, LO M47K, LY M47K Source: http://www.osram.convergy.de/
MIXER_A MIXER_B = analog-audio-chips:SSM2164_MULTI: Low Cost Quad Voltage Controlled Amplifier by Analog Devices (120 dB Gain Range)
OUT = con-amp-quick:MA02: AMP QUICK CONNECTOR; OC_FARNELL: unknown; OC_NEWARK: unknown
POT_SUM_STG = pot:3RP/1610N: 16mm Potentiometer one level Source: http://www.alphapotentiometers.net/html/16mm_pot_2.html
R1_3 R1_4 R1_7 R1_8 R1_EXPCONV2 R1_PWM1 R1_PWM3 R1_VCA R1_VCF R1S_1 R2_3 R2_4 R2_7 R2_8 R2_EXPCONV2 R2_PWM1 R2_PWM3 R2_VCA R2_VCF R2S_1 R3_1 R3_3 R3_4 R3_EXPCONV2 R3_VCA R3S_1 R4_EXPCONV2 R4_VCA R5_1 R5_3 R5_EXPCONV2 R5_VCA R6_1 R6_3 R7_1 R7_3 R8_1 R8_3 R10_1 R10_3 R11_1 R11_3 R_CONV_ITOV_OUT R_CV_FREQ1 R_CV_FREQ3 R_CV_FREQ_BIAS1 R_CV_FREQ_BIAS3 R_CV_FREQ_STAB1 R_CV_FREQ_STAB3 R_GAIN_VCA R_LIM_2 R_PD_4TH_ORDER_VCF R_PD_411_IN_PULSE1 R_PD_411_IN_SAW1 R_PD_411_IN_SYNC1 R_PD_411_IN_TRI1 R_RES_VCF R_SYNC1 R_SYNC3 RA_2 RB1_VCF RB2 RB3_VCF RBIAS_EXPCONV2 RC1_VCF RC2_VCF RC3 RC4 RCAL_1 RCAL_2 REE_2 REE_VCF RF1_VCF RF2_VCF RF3 RF4 RIN1_MIXERA RIN2_MIXERA RIN2_MIXERB RIN3_MIXERA RIN3_MIXERB RIN4_MIXERA RIN4_MIXERB RIN4_MIXERB1 RMODE_MIXERA RMODE_MIXERB ROUT_SUM_STG RRI_VCF RSQU_2 RSTAB1_MIXERA RSTAB2_MIXERA RSTAB2_MIXERB RSTAB3_MIXERA RSTAB3_MIXERB RSTAB4_MIXERA RSTAB4_MIXERB RSTAB4_MIXERB1 RSTAB4_MIXERB2 RTEST_13700FREQ2 RTEST_LOG2 RTRI_2 SUM_STG_R = rcl:R-EU_: RESISTOR, European symbol; SPICEPREFIX: R
R_LD2 R_PU_DSA R_PU_SCL = 6P1_EVB:R-US_: RESISTOR, American symbol
S1 = switch-omron:10-XX: OMRON SWITCH; MPN: B3F-1000; OC_FARNELL: 176432; OC_NEWARK: 36M3542
STM32L432KC_CONN_ = NUCLEO-F303K8:NUCLEO-F303K8: STM32 Nucleo-32 development board with STM32F303K8T6 MCU, supports Arduino connectivity; DESCRIPTION: STM32 Nucleo-32 development board with STM32F303K8T6 MCU, supports Arduino connectivity; DIGI-KEY_PART_NUMBER: 497-15981-ND; DIGI-KEY_PURCHASE_URL: https://www.digikey.fr/product-detail/en/stmicroelectronics/NUCLEO-F303K8/497-15981-ND/5428805?utm_source=snapeda&utm_medium=aggregator&utm_campaign=symbol; MF: STMicroelectronics; MP: NUCLEO-F303K8; PACKAGE: None
SUBBASS2 = HEF4027BP:HEF4027BP: Dual JK flip-flop; AVAILABILITY: Unavailable; DESCRIPTION: Dual J-K flip-flop w/set&reset HEF4027BP; MF: NXP Semiconductors; MP: HEF4027BP; PACKAGE: DIP-16 NXP Semiconductors; PRICE: None
TP_13700_SQU2 TP_13700_TRI2 TP_CV_2 TP_PULSE1 TP_PULSE3 TP_SAW1 TP_SAW3 TP_TRI1 TP_TRI3 = 6P1_EVB:TESTPOINT
U1 = Analog Devices - AD5391BSTZ-3:ANALOG_DEVICES_AD5391BSTZ-3: ADI-AD5391-ST-52; CIIVA_IDS: 963769; CODE__JEDEC: MS-026-BCC; COMPONENT_LINK_1_DESCRIPTION: Manufacturer URL; COMPONENT_LINK_1_URL: http://www.analog.com/en/index.html; COMPONENT_LINK_3_DESCRIPTION: Package Specification; COMPONENT_LINK_3_URL: http://www.analog.com/static/imported-files/packages/61012411624300842189414155189544791816408612ST_52_10x10.pdf; COMPONENT_LINK_4_DESCRIPTION: Product URL; COMPONENT_LINK_4_URL: http://www.analog.com/en/digital-to-analog-converters/da-converters/ad5391/products/product.html; COMPONENT_LINK_5_DESCRIPTION: Reference Design URL; COMPONENT_LINK_5_URL: http://www.analog.com/en/digital-to-analog-converters/da-converters/ad5391/products/product.html#prod_cross_sell; DAC_OUTPUTS: 16; DATASHEET: http://www.analog.com/static/imported-files/data_sheets/AD5390_5391_5392.pdf; DATASHEET_VERSION: Rev. D; FOOTPRINT_VARIANT_NAME_0: Level C; FOOTPRINT_VARIANT_NAME_1: Level B; FOOTPRINT_VARIANT_NAME_2: Level A; IMPORTED: yes; IMPORTED_FROM: vault; IMPORT_TS: 1521844584; MAX_V: 5.5V; MF: Analog Devices; MOUNTING_TECHNOLOGY: Surface Mount; MPN: AD5391BSTZ-3; PACKAGE: ST-52; PACKAGE_DESCRIPTION: 52-Lead Low Profile Quad Flat Package [LQFP]; PACKAGE_VERSION: 2003; PACKING: Tray; PIN_0_0_34_INSIDE_EDGE: clock; PREFIX: U; RELEASE_DATE: 1387056567; RESOLUTION_BITS: 12; ROHS: Yes; SETTLING_TIME: 6Âμs; SINGLE_SUPPLY: Yes; VAULT_GUID: 913198B3-F412-43EF-AC7C-B6DE02DEBA47; VAULT_REVISION: 29455BC3-2BA2-49F7-B0A5-12DEF9066172
VCA VCO2 = ota:LM13700: Dual OTA with buffers
VCF = analog-audio-chips:AS3320: Voltage Controlled Filter capable of 4th order LP, BP or HP designed by famous audio chips designer Curtis Electronics.
VCF_ANALOG_SW = linear:DG413DJ: CMOS SWITCH
VCF_JUMPER = con-lstb:MA04-1: PIN HEADER; OC_FARNELL: unknown; OC_NEWARK: unknown